# Altium schematic sheet MCISO-S02-V00-PSU5VB.SchDoc
size A4; SheetNumber: 5; SheetTotal: 5
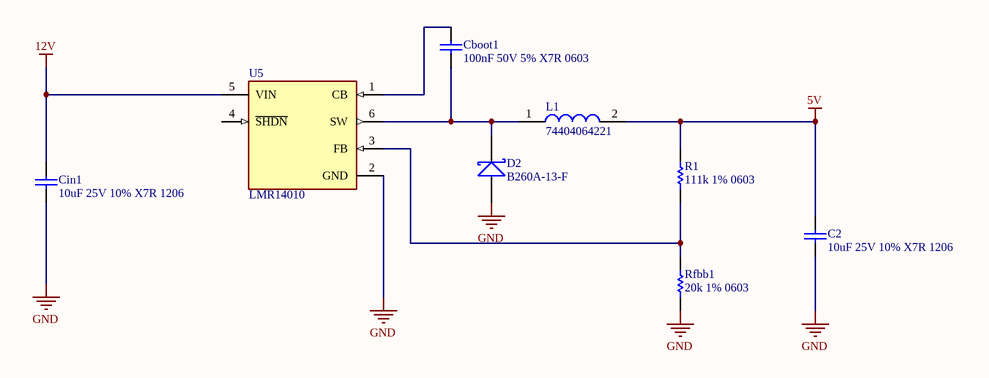
[diagram p0: MCISO-S02-V00-PSU5VB.SchDoc]

## Parts
C2  10uF 25V 10% X7R 1206  [Cap_Ceramic_1206]
Cboot1  100nF 50V 5% X7R 0603  [Cap_Ceramic_0603]
Cin1  10uF 25V 10% X7R 1206  [Cap_Ceramic_1206]
D2  B260A-13-F  [SMA]
L1  74404064221  [Inductor_6x6mm]
R1  111k 1% 0603  [Res_ThinFilm_0603]
Rfbb1  20k 1% 0603  [Res_ThinFilm_0603]
U5  LMR14010  [LMR14010]

## Nets
5V: C2.2 L1.2 R1.2
12V: Cin1.2 U5.5(VIN)
GND: C2.1 Cin1.1 D2.A Rfbb1.1 U5.2(GND)
NetCboot1_1: Cboot1.1 D2.K L1.1 U5.6(SW)
NetCboot1_2: Cboot1.2 U5.1(CB)
NetR1_1: R1.1 Rfbb1.2 U5.3(FB)

Not connected (* = marked no-connect by the designer): U5 4(~{SHDN})

## Library data of the parts
C2 Cin1 = 10uF 25V 10% X7R 1206: Capacitor, Ceramic, SMD, 10uF, 25V, 10%, X7R, 1206
Cboot1 = 100nF 50V 5% X7R 0603: Capacitor, Ceramic, SMD, 100nF, 50V, 5%, X7R, 0603
D2 = B260A-13-F: Diode, Schottky Barrier Rectifier, 60 V, 2 A, B260A-13-F
L1 = 74404064221: FIXED IND 220UH 660MA 850 MOHM; ComponentLink1Description: Digikey; ComponentLink1URL: https://www.digikey.com.au/product-detail/en/w%C3%BCrth-elektronik/74404064221/732-7261-1-ND/5353241; ComponentLink2Description: LCSC A; ComponentLink2URL: https://lcsc.com/product-detail/Power-Inductors_Sunlord-SWPA6045S221MT_C91047.html; ComponentLink3Description: LCSC B; ComponentLink3URL: https://lcsc.com/product-detail/Power-Inductors_SXN-Shun-Xiang-Nuo-Elec-SMNR6045-221MT_C467145.html
R1 = 111k 1% 0603: Resistor, SMD, 111k, 0.1W, 1%, 0603
Rfbb1 = 19k6 1% 0603: Resistor, SMD, 19k6, 0.1W, 5%, 0603